# EAGLE design Sensor-led (EAGLE 6.5.0)
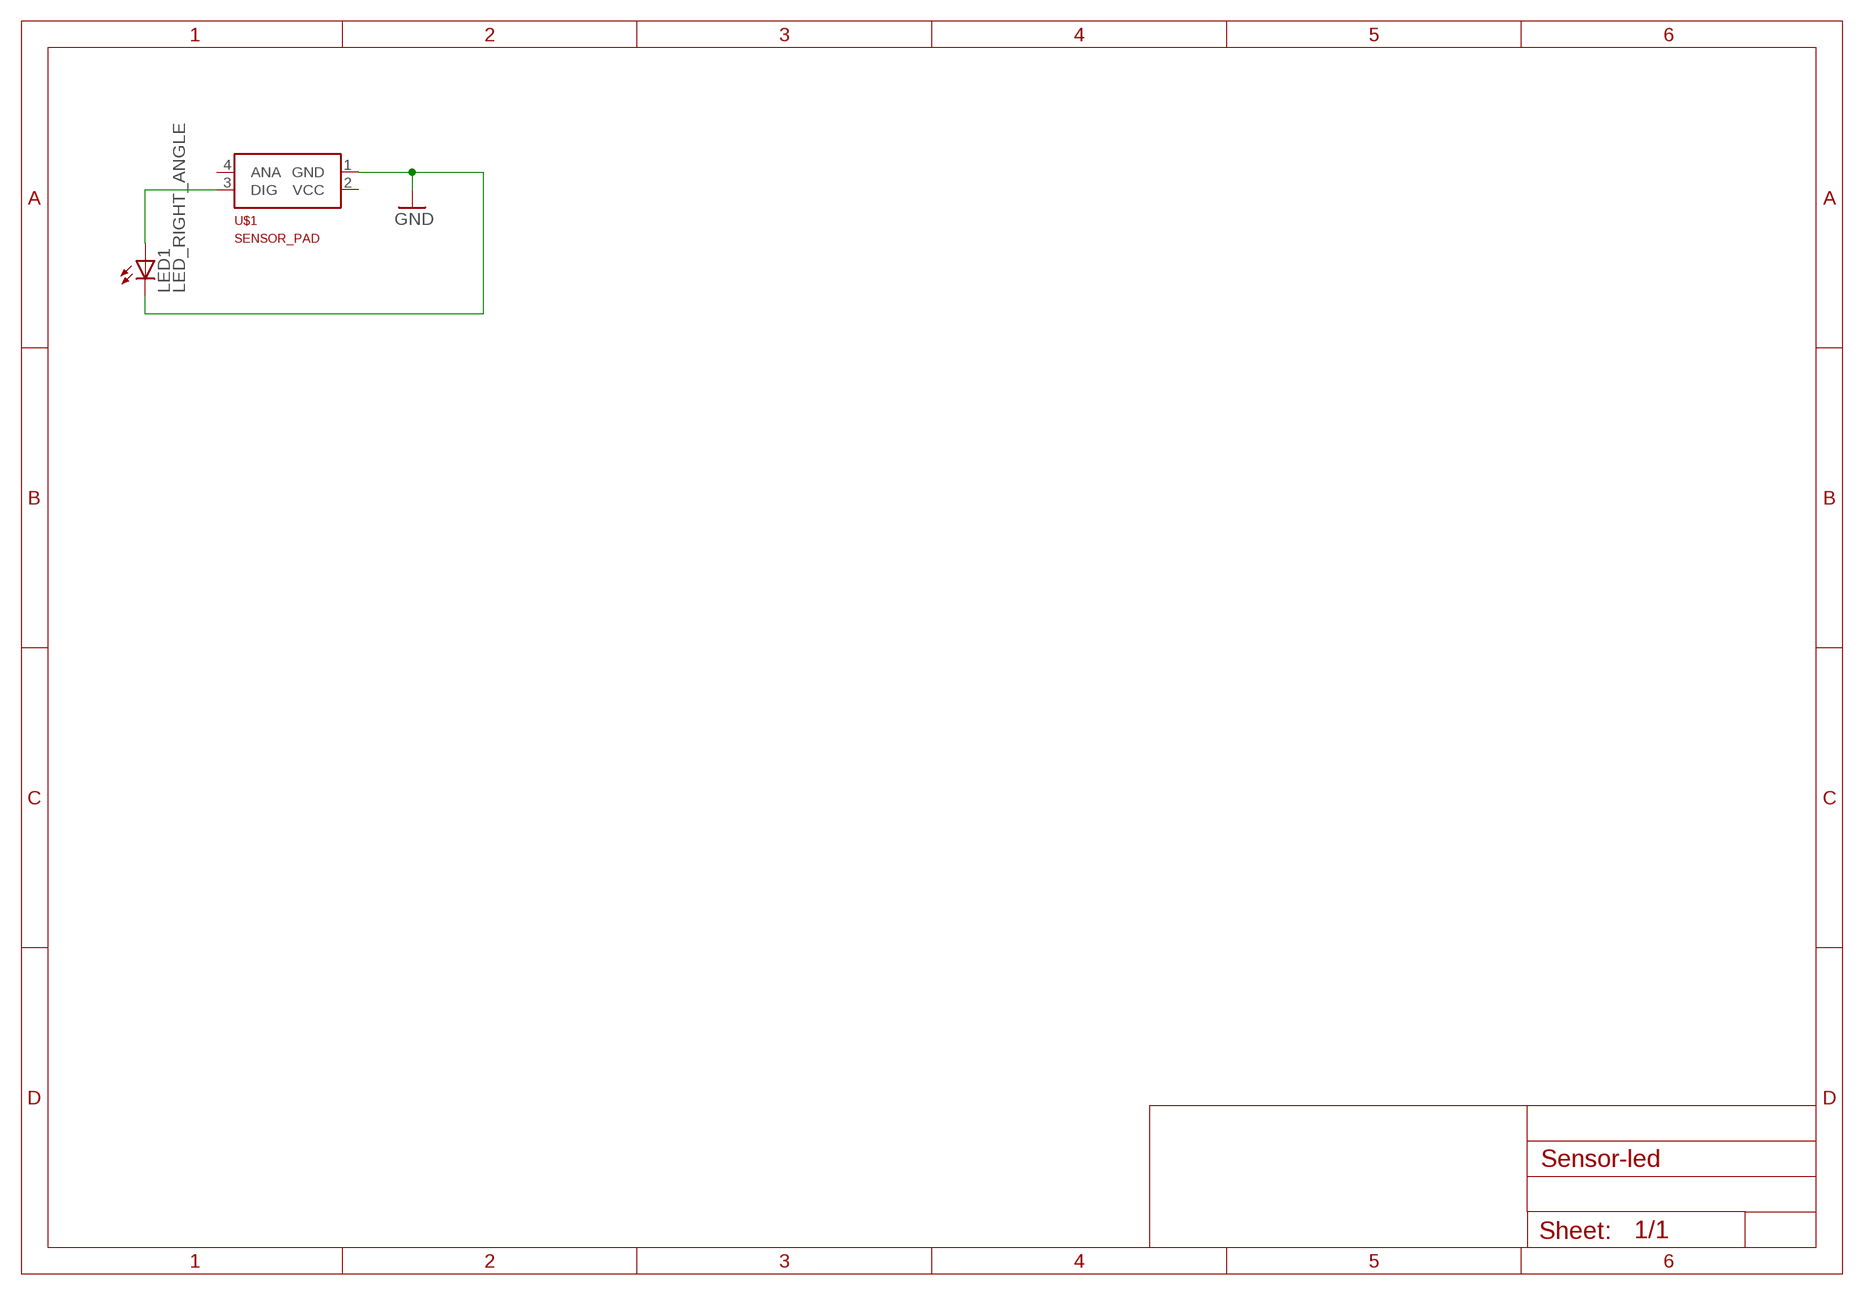
[diagram p0: schematic, sheet 1]

## Parts
LED1  LED_RIGHT_ANGLE  [LED_RIGHT_ANGLE]
U$1  SENSOR_PAD  [SENSOR_PAD]

## Nets
GND: LED1.CATHODE(C) U$1.1(GND)
N$1: LED1.ANODE(A) U$1.3(DIG)
Unconnected: U$1.2(VCC) U$1.4(ANA)

## Library data of the parts
LED1 = sduino:LED_RIGHT_ANGLE
U$1 = sduino:SENSOR_PAD; OC_FARNELL: unknown

## Board
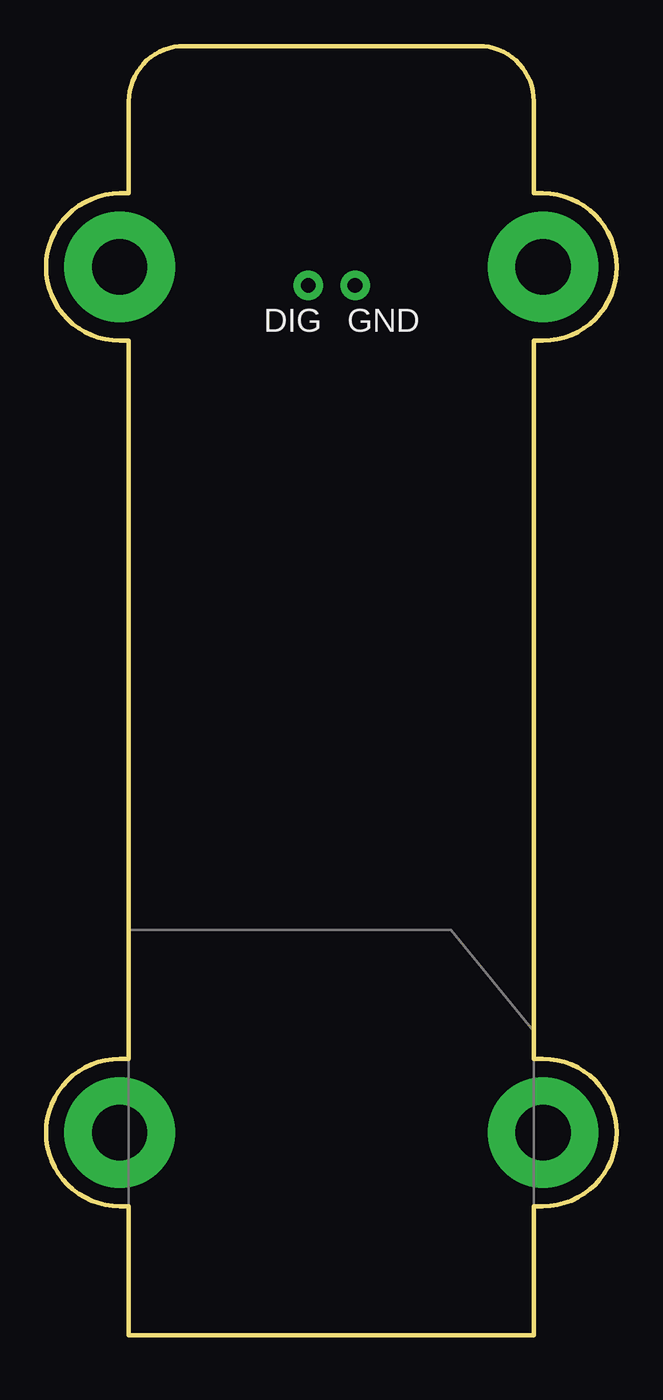
[diagram p1: board, top side]
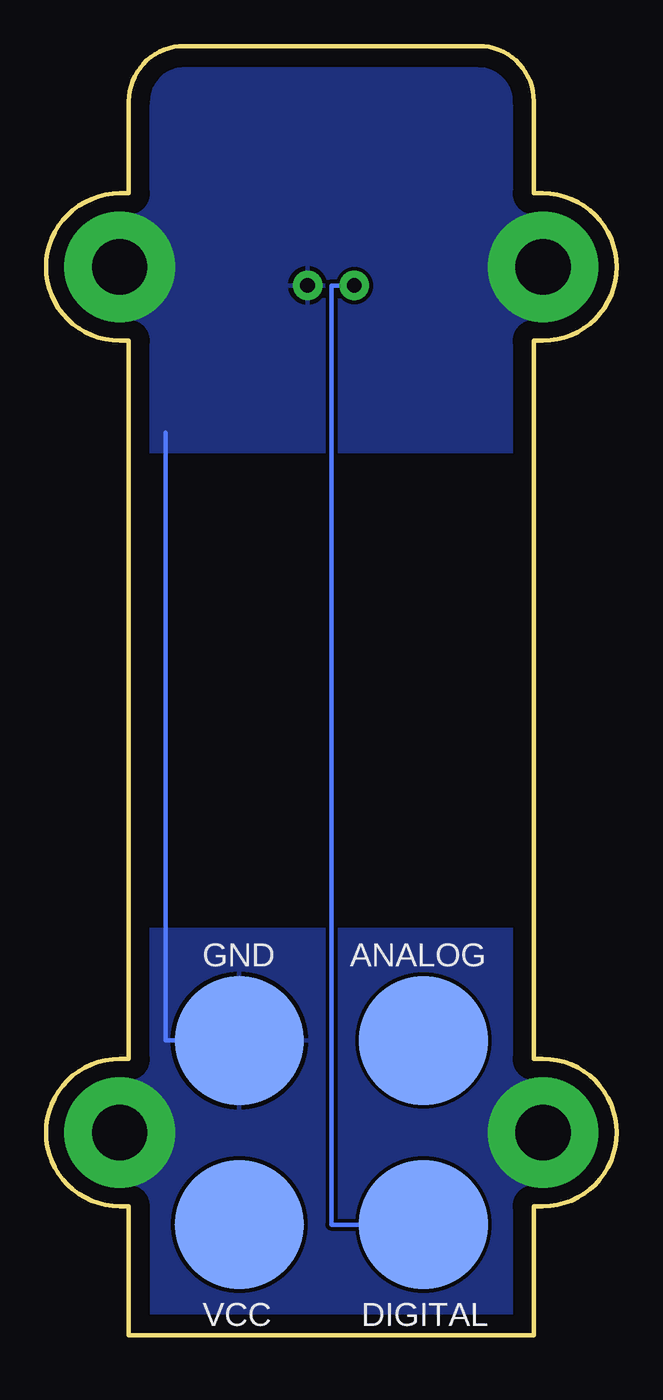
[diagram p2: board, bottom side, seen from below]

Size 31 x 70 mm. Coordinates in mm from the lower left corner, seen from the top.
Outline: 26.5,0 4.5,0 4.5,7 4,7 arc-180 4,15 4.5,15 4.5,54 4,54 arc-180 4,62 4.5,62 4.5,67 arc-90 7.5,70 23.5,70 arc-90 26.5,67 26.5,62 27,62 arc-180 27,54 26.5,54 26.5,15 27,15 arc-180 27,7 26.5,7 26.5,0
Copper layers (1*16): Top 0.035mm / dielectric 1.5mm / Bottom 0.035mm
Design rules "default *": minimum track width 10mil, minimum drill 24mil, track to track 8mil, track to pad 8mil, pad to pad 8mil, via to via 8mil, smd to smd 8mil, copper to edge 40mil, drill to drill 8mil, minimum pad ring 10mil, minimum via ring 8mil, stop-mask expansion 4mil, vias tented up to drill 50mil, thermal gap 10mil

### Footprints (pad centres in the part's own frame; a part is rotated, then mirrored left to right if it is on the bottom)
LED_RIGHT_ANGLE = drill 0.8 pad 1.6: ANODE 0,0; CATHODE 2.54,0
SENSOR_PAD = smd 7 x 7 bottom: 1 16,16; 2 16,6; 3 6,6; 4 6,16

### Placement (x,y rotation side)
LED1  14.25,57 0 top
U$1  4.5,0 0 top

### Tracks (layer width: path | path; a pad name or v marks a point on that pad's centre or on a via)
GND  (via drill 3 pad 6)
  Bottom 0.254: U$1.1 24.5,16 24.5,49
  other vias: 4,58 27,58 4,11 27,11
  pour Bottom: -1.5,22 -1.5,-2 33.5,-2 33.5,22
  pour Bottom: -1.5,72 -1.5,48 33.5,48 33.5,72
N$1
  Bottom 0.254: LED1.ANODE 15.5,57 15.5,6 U$1.3